# EAGLE design h_bridge_new (EAGLE 5.11)
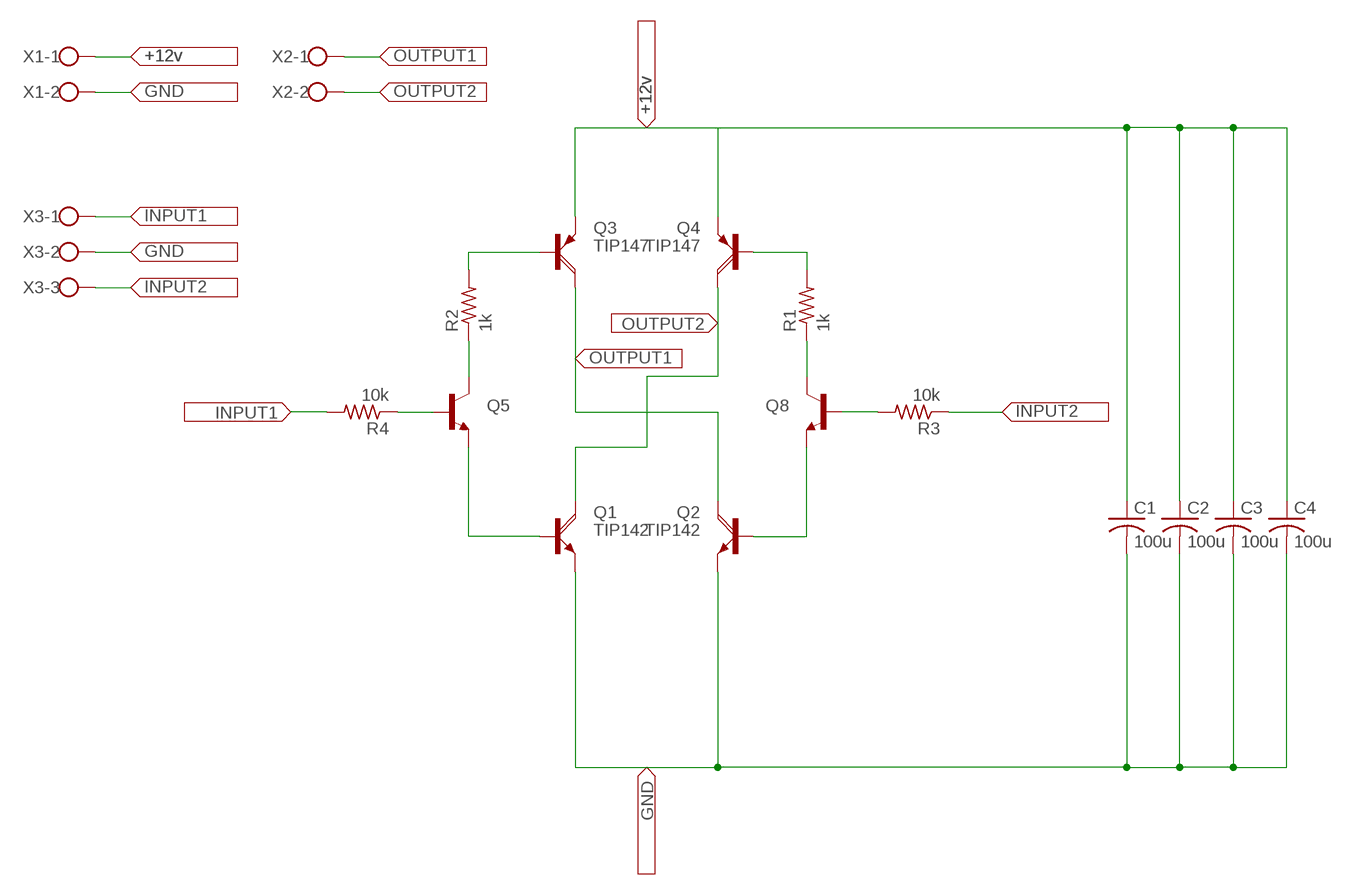
[diagram p0: schematic, sheet 1]

## Parts
C1  100u  C-US025-025X050  [C025-025X050]
C2  100u  C-US025-025X050  [C025-025X050]
C3  100u  C-US025-025X050  [C025-025X050]
C4  100u  C-US025-025X050  [C025-025X050]
Q1  TIP142  [SOT93]
Q2  TIP142  [SOT93]
Q3  TIP147  [SOT93]
Q4  TIP147  [SOT93]
Q5  TRANSISTOR_NPNTO92  [TO-92]
Q8  TRANSISTOR_NPNTO92  [TO-92]
R1  1k  R-US_0207/15  [0207/15]
R2  1k  R-US_0207/15  [0207/15]
R3  10k  R-US_0207/15  [0207/15]
R4  10k  R-US_0207/15  [0207/15]
X1  W237-02P  [W237-132]
X2  W237-02P  [W237-132]
X3  W237-03P  [W237-133]

## Nets
+12V: C1.1 C2.1 C3.1 C4.1 Q3.E Q4.E X1.1
GND: C1.2 C2.2 C3.2 C4.2 Q1.E Q2.E X1.2 X3.2
INPUT1: R4.2 X3.1
INPUT2: R3.1 X3.3
N$1: Q5.3(C) R2.1
N$2: Q3.B R2.2
N$3: Q4.B R1.2
N$4: Q8.3(C) R1.1
N$5: Q1.B Q5.1(E)
N$6: Q2.B Q8.1(E)
N$7: Q5.2(B) R4.1
N$8: Q8.2(B) R3.2
OUTPUT1: Q2.C Q3.C X2.1
OUTPUT2: Q1.C Q4.C X2.2

## Library data of the parts
C1-C4 = resistor:C-US: CAPACITOR, American symbol
Q1 Q2 = transistor-power:TIP142: NPN DARLINGTON TRANSISTOR
Q3 Q4 = transistor-power:TIP147: PNP DARLINGTON TRANSISTOR
Q5 Q8 = SparkFun:TRANSISTOR_NPN: Transistor NPN BJT configuration in SOT23 package. MMBT2222 is the common NPN we use. Double check BCE configuration again layout.
R1-R4 = resistor:R-US_: RESISTOR, American symbol
X1 X2 = con-wago-508:W237-02P: WAGO SREW CLAMP
X3 = con-wago-508:W237-03P: WAGO SREW CLAMP

## Board
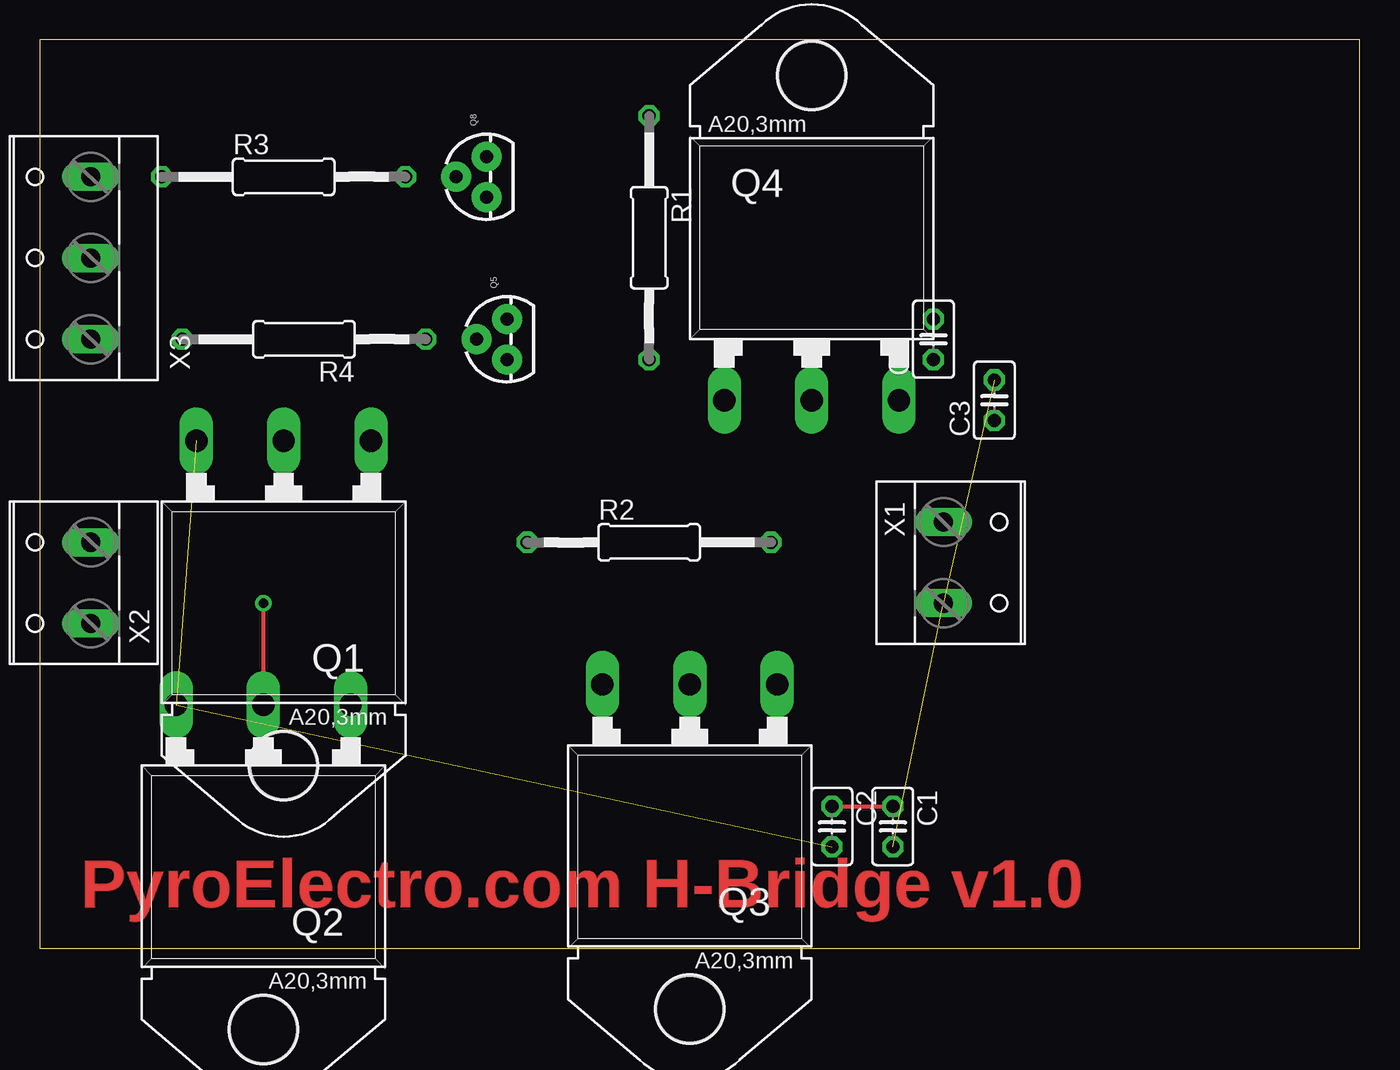
[diagram p1: board, top side]
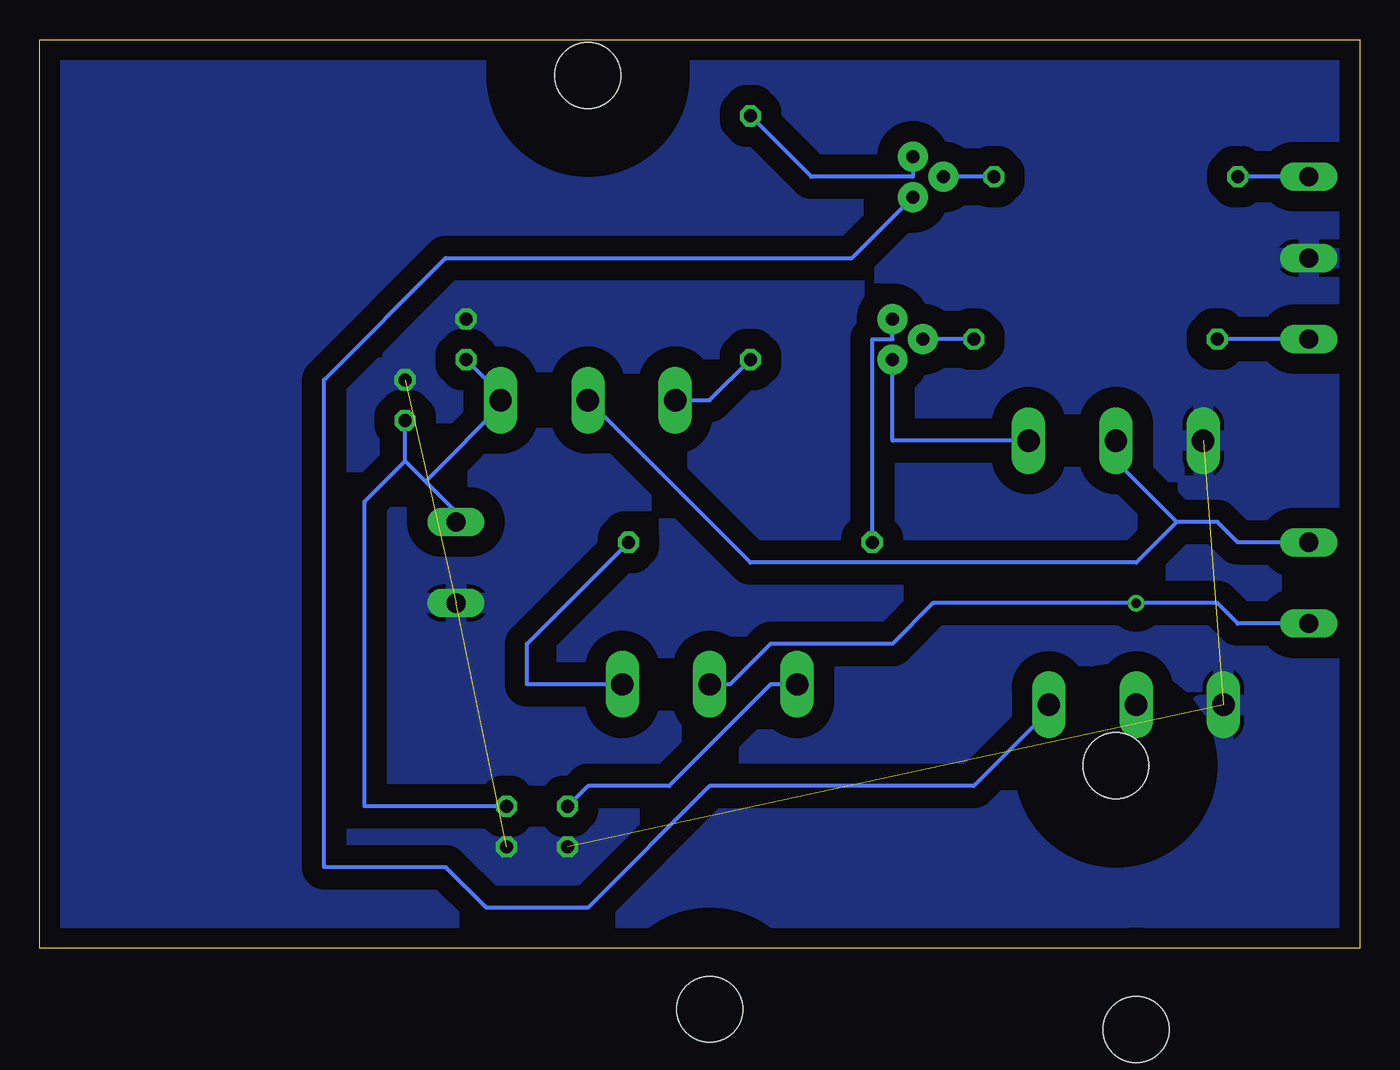
[diagram p2: board, bottom side, seen from below]

Size 82.53 x 56.82 mm. Coordinates in mm from the lower left corner, seen from the top.
Outline: 0,0 82.53,0 82.53,56.82 0,56.82 0,0
Copper layers (1*16): Top 0.035mm / dielectric 1.5mm / Bottom 0.035mm
Design rules "default": minimum track width 10mil, minimum drill 24mil, track to track 8mil, track to pad 8mil, pad to pad 8mil, via to via 8mil, smd to smd 8mil, copper to edge 40mil, drill to drill 8mil, minimum pad ring 10mil, minimum via ring 8mil, stop-mask expansion 4mil, vias tented up to drill 0mil, thermal gap 10mil

### Footprints (pad centres in the part's own frame; a part is rotated, then mirrored left to right if it is on the bottom)
C025-025X050 = drill 0.813 octagon: 1 -1.27,0; 2 1.27,0
SOT93 = drill 1.397 long: B -5.461,-10.16; C 0,-10.16; E 5.461,-10.16 | hole 4.115: 0,10.16
TO-92 = drill 0.813 pad 1.88 round: 1 -1.27,0; 2 0,1.905; 3 1.27,0
0207/15 = drill 0.813 octagon: 1 -7.62,0; 2 7.62,0
W237-132 = drill 1.194 long: 1 -2.54,-0.635; 2 2.54,-0.635
W237-133 = drill 1.194 long: 1 -5.08,-0.635; 2 0,-0.635; 3 5.08,-0.635

### Placement (x,y rotation side)
C1  53.34,7.62 270 top
C2  49.53,7.62 270 top
C3  59.69,34.29 90 top
C4  55.88,38.1 90 top
Q1  15.24,21.59 180 top
Q2  13.97,5.08 180 top
Q3  40.64,6.35 180 top
Q4  48.26,44.45 0 top
Q5  29.21,38.1 90 top
Q8  27.94,48.26 90 top
R1  38.1,44.45 270 top
R2  38.1,25.4 0 top
R3  15.24,48.26 0 top
R4  16.51,38.1 180 top
X1  57.15,24.13 270 top
X2  2.54,22.86 90 top
X3  2.54,43.18 90 top

### Tracks (layer width: path | path; a pad name or v marks a point on that pad's centre or on a via)
+12V
  Top 0.254: C2.1 C1.1 | X1.1 55.88,26.67
  Bottom 0.254: 59.69,30.48 C3.1 | 58.42,29.21 55.88,26.67 X1.1 | 59.69,30.48 58.42,29.21 | 53.34,34.29 C4.1 | 58.42,29.21 53.34,34.29 | 53.34,34.29 Q4.E | C2.1 48.26,10.16 43.18,10.16 36.83,16.51 Q3.E | 59.69,30.48 62.23,27.94 62.23,8.89 C1.1
GND  (4 unrouted)
  pour Bottom (isolate 1.27): 0,57.15 82.55,55.88 82.55,0 0,0
INPUT1
  Bottom 0.254: X3.1 R4.2
INPUT2
  Bottom 0.254: X3.3 R3.1
N$1
  Bottom 0.254: R2.1 30.48,38.1 29.21,38.1 Q5.3
N$2
  Bottom 0.254: R2.2 52.07,19.05 52.07,16.51 Q3.B
N$3
  Bottom 0.254: R1.2 40.64,34.29 Q4.B
N$4
  Bottom 0.254: R1.1 34.29,48.26 27.94,48.26 Q8.3
N$5
  Bottom 0.254: Q5.1 29.21,31.75 Q1.B
N$6
  Top 0.254: 20.32,16.51 20.32,15.24 Q2.B
  Bottom 0.254: 19.05,15.24 20.32,16.51 | Q8.1 31.75,43.18 57.15,43.18 64.77,35.56 64.77,5.08 57.15,5.08 54.61,2.54 48.26,2.54 40.64,10.16 24.13,10.16 19.05,15.24 | Q2.B 19.05,15.24
N$7
  Bottom 0.254: R4.1 Q5.2
N$8
  Bottom 0.254: R3.2 Q8.2
OUTPUT1  (via drill 0.61)
  Top 0.254: v13.97,21.59 Q2.C
  Bottom 0.254: Q3.C 39.37,16.51 36.83,19.05 29.21,19.05 26.67,21.59 v13.97,21.59 8.89,21.59 7.62,20.32 X2.1
OUTPUT2
  Bottom 0.254: 11.43,26.67 8.89,26.67 7.62,25.4 X2.2 | 11.43,26.67 15.24,30.48 Q1.C | Q4.C 38.1,24.13 13.97,24.13 11.43,26.67

### Text on the board
Top: PyroElectro.com H-Bridge v1.0